# Altium schematic sheet ETH1G_RJ45_JUMPER.SchDoc
size A3; SheetNumber: 5; SheetTotal: 22
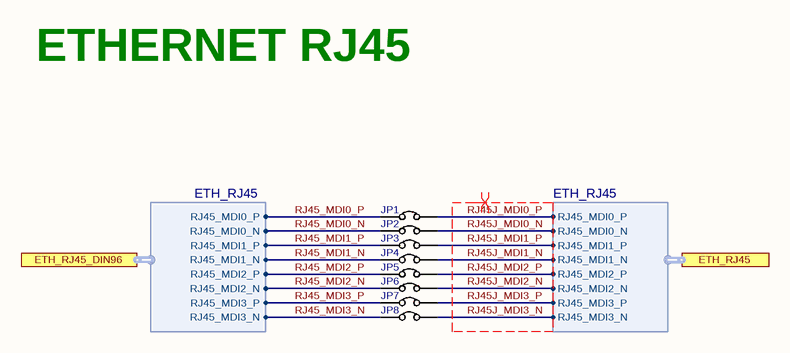
[diagram p0: ETH1G_RJ45_JUMPER.SchDoc]

## Parts
JP1  JMPSOLDER  [JP_30X50]  (value not drawn)
JP2  JMPSOLDER  [JP_30X50]  (value not drawn)
JP3  JMPSOLDER  [JP_30X50]  (value not drawn)
JP4  JMPSOLDER  [JP_30X50]  (value not drawn)
JP5  JMPSOLDER  [JP_30X50]  (value not drawn)
JP6  JMPSOLDER  [JP_30X50]  (value not drawn)
JP7  JMPSOLDER  [JP_30X50]  (value not drawn)
JP8  JMPSOLDER  [JP_30X50]  (value not drawn)

## Ports
ETH_RJ45 (harness ETH_RJ45), ETH_RJ45_DIN96 (harness ETH_RJ45)

## Harnesses
ETH_RJ45: RJ45_MDI0_P, RJ45_MDI0_N, RJ45_MDI1_P, RJ45_MDI1_N, RJ45_MDI2_P, RJ45_MDI2_N, RJ45_MDI3_P, RJ45_MDI3_N

## Nets
RJ45_MDI0_N: JP2.1 ; port ETH_RJ45_DIN96.RJ45_MDI0_N
RJ45_MDI0_P: JP1.1 ; port ETH_RJ45_DIN96.RJ45_MDI0_P
RJ45_MDI1_N: JP4.1 ; port ETH_RJ45_DIN96.RJ45_MDI1_N
RJ45_MDI1_P: JP3.1 ; port ETH_RJ45_DIN96.RJ45_MDI1_P
RJ45_MDI2_N: JP6.1 ; port ETH_RJ45_DIN96.RJ45_MDI2_N
RJ45_MDI2_P: JP5.1 ; port ETH_RJ45_DIN96.RJ45_MDI2_P
RJ45_MDI3_N: JP8.1 ; port ETH_RJ45_DIN96.RJ45_MDI3_N
RJ45_MDI3_P: JP7.1 ; port ETH_RJ45_DIN96.RJ45_MDI3_P
RJ45J_MDI0_N: JP2.2 ; port ETH_RJ45.RJ45_MDI0_N
RJ45J_MDI0_P: JP1.2 ; port ETH_RJ45.RJ45_MDI0_P
RJ45J_MDI1_N: JP4.2 ; port ETH_RJ45.RJ45_MDI1_N
RJ45J_MDI1_P: JP3.2 ; port ETH_RJ45.RJ45_MDI1_P
RJ45J_MDI2_N: JP6.2 ; port ETH_RJ45.RJ45_MDI2_N
RJ45J_MDI2_P: JP5.2 ; port ETH_RJ45.RJ45_MDI2_P
RJ45J_MDI3_N: JP8.2 ; port ETH_RJ45.RJ45_MDI3_N
RJ45J_MDI3_P: JP7.2 ; port ETH_RJ45.RJ45_MDI3_P

## Layout directives
differential pair: RJ45J_MDI0_N, RJ45J_MDI0_P, RJ45J_MDI1_N, RJ45J_MDI1_P, RJ45J_MDI2_N, RJ45J_MDI2_P, RJ45J_MDI3_N, RJ45J_MDI3_P

## Notes on the sheet
- ETHERNET RJ45

## Library data of the parts
JP1-JP8 = JUMPER_SOLDER: JUMPER, HEADER 2PIN; MANF: MANF; MANF_P#: MANF_P#; VALUE: JMPSOLDER